# EasyEDA schematic PCB_7_3D.json
TITLE: Sheet_1; REV: 1.0; Date: 2021-05-28; Sheet: 1/1; Company: Your Company
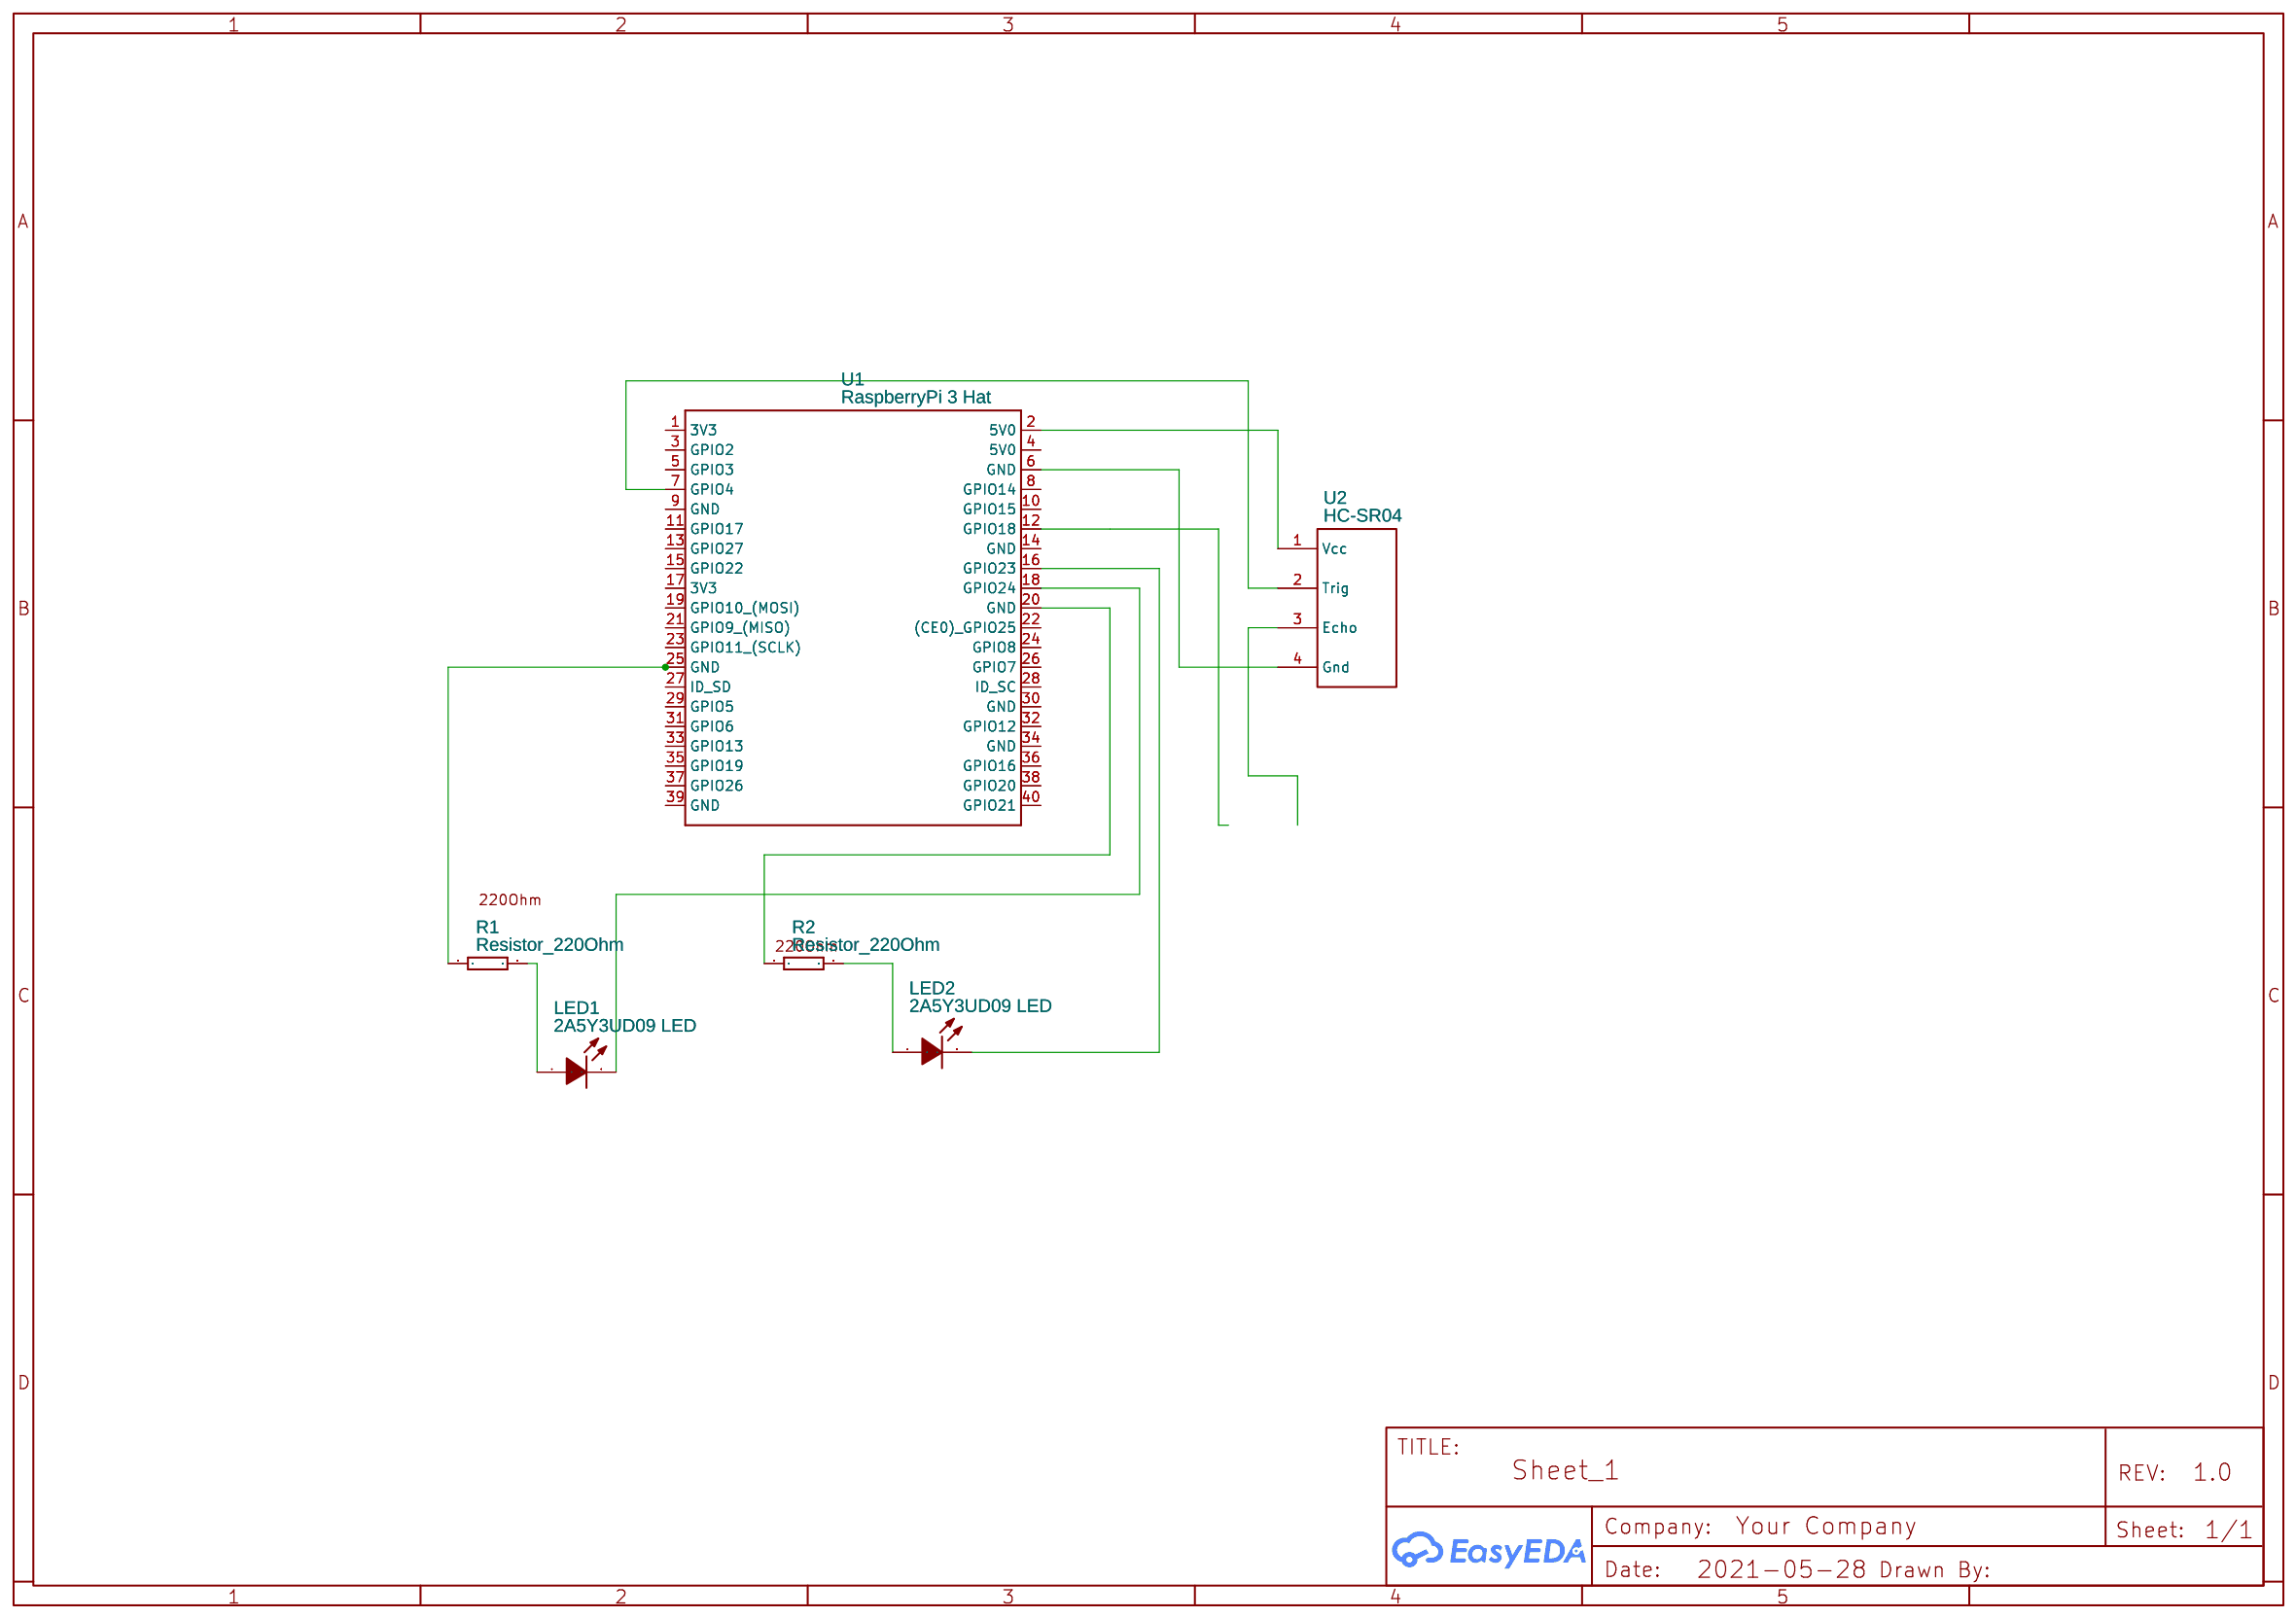
[diagram p0: schematic sheet]

## Parts
LED1  2A5Y3UD09 LED  [LED-SMD_L5.0-W2.7-FD]
LED2  2A5Y3UD09 LED  [LED-SMD_L5.0-W2.7-FD]
R1  Resistor_220Ohm  [RESISTOR_220OHM]
R2  Resistor_220Ohm  [RESISTOR_220OHM]
U1  RaspberryPi 3 Hat  [RASBERRYPI-3-HAT]
U2  HC-SR04  [HC-SR04]

## Library data of the parts
LED1 LED2 = 2A5Y3UD09 LED: Supplier: LCSC; Manufacturer: KENTO; Supplier Part: C3651
R1 R2 = Resistor_220Ohm: Contributor: Destora
U1 = RaspberryPi 3 Hat: Manufacturer Part: RaspberryPi 3; Contributor: lynxlabeling
U2 = HC-SR04: Contributor: benjamin.ferreusmfg

## Nets
Net-(LED1-1): LED1.1(+) R1.2
Net-(LED1-2): LED1.2(-) U1.18(GPIO24)
Net-(LED2-1): LED2.1(+) R2.2
Net-(LED2-2): LED2.2(-) U1.16(GPIO23)
Net-(R1-1): R1.1 U1.25(GND)
Net-(R2-1): R2.1 U1.20(GND)
Net-(U1-2): U1.2(5V0) U2.1(Vcc)
Net-(U1-6): U1.6(GND) U2.4(Gnd)
Net-(U1-7): U1.7(GPIO4) U2.2(Trig)

Not connected (* = marked no-connect by the designer): U1 1(3V3) 3(GPIO2) 4(5V0) 5(GPIO3) 8(GPIO14) 9(GND) 10(GPIO15) 11(GPIO17) 12(GPIO18) 13(GPIO27) 14(GND) 15(GPIO22) 17(3V3) 19(GPIO10 (MOSI)) 21(GPIO9 (MISO)) 22((CE0) GPIO25) 23(GPIO11 (SCLK)) 24(GPIO8) 26(GPIO7) 27(ID_SD) 28(ID_SC) 29(GPIO5) 30(GND) 31(GPIO6) 32(GPIO12) 33(GPIO13) 34(GND) 35(GPIO19) 36(GPIO16) 37(GPIO26) 38(GPIO20) 39(GND) 40(GPIO21); U2 3(Echo)
